# Altium schematic sheet MotorDriverL298.SchDoc
size A
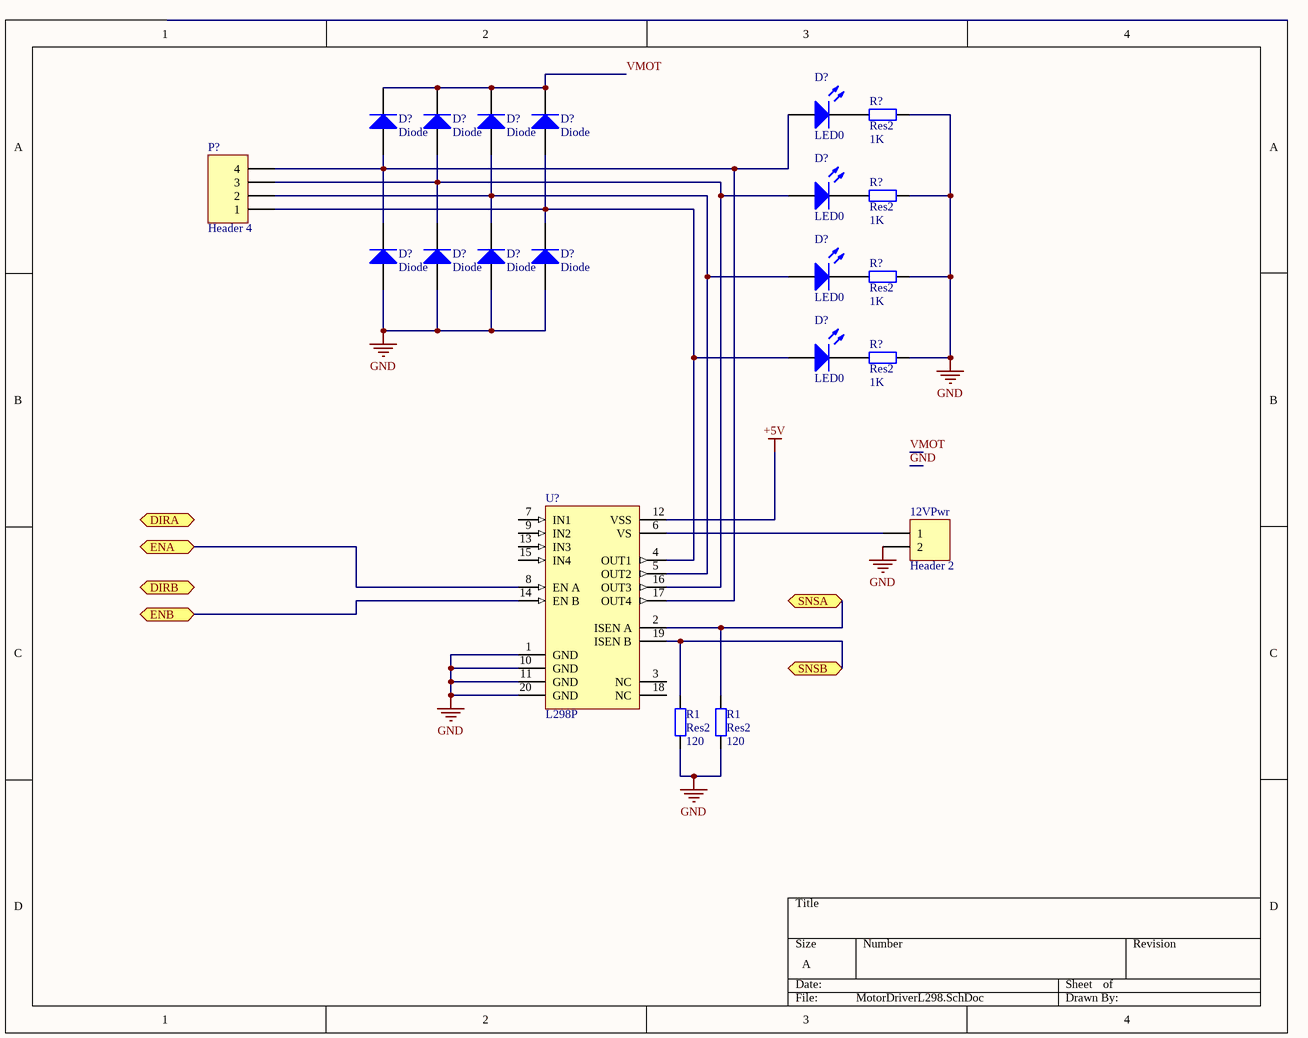
[diagram p0: MotorDriverL298.SchDoc]

## Parts
(Parts that share a designator on the sheet are numbered #1, #2 ... from top to bottom, then left to right.)
12VPwr  Header 2  [HDR1X2]
D?#1  LED0  [LED-0]
D?#2  Diode  [SMC]
D?#3  Diode  [SMC]
D?#4  Diode  [SMC]
D?#5  Diode  [SMC]
D?#6  LED0  [LED-0]
D?#7  Diode  [SMC]
D?#8  Diode  [SMC]
D?#9  Diode  [SMC]
D?#10  Diode  [SMC]
D?#11  LED0  [LED-0]
D?#12  LED0  [LED-0]
P?  Header 4  [HDR1X4]
R1#1  Res2  value 120  [AXIAL-0.4]
R1#2  Res2  value 120  [AXIAL-0.4]
R?#1  Res2  value 1K  [AXIAL-0.4]
R?#2  Res2  value 1K  [AXIAL-0.4]
R?#3  Res2  value 1K  [AXIAL-0.4]
R?#4  Res2  value 1K  [AXIAL-0.4]
U?  L298P  [PowerSO20_N]

## Ports
DIRA, DIRB, ENA, ENB, SNSA, SNSB

## Nets
+5V: U?.12(VSS)
GND: 12VPwr.2 D?#7.1(A) D?#8.1(A) D?#9.1(A) D?#10.1(A) R1#1.1 R1#2.1 R?#1.2 R?#2.2 R?#3.2 R?#4.2 U?.1(GND) U?.10(GND) U?.11(GND) U?.20(GND)
ENA: U?.8(EN_A) ; port ENA
ENB: U?.14(EN_B) ; port ENB
SNSA: R1#2.2 U?.2(ISEN_A) ; port SNSA
SNSB: R1#1.2 U?.19(ISEN_B) ; port SNSB
VMOT: D?#2.2(K) D?#3.2(K) D?#4.2(K) D?#5.2(K)
Net12VPwr_1: 12VPwr.1 U?.6(VS)
NetD?#1_1: D?#1.1(A) D?#2.1(A) D?#7.2(K) P?.4 U?.17(OUT4)
NetD?#1_2: D?#1.2(K) R?#1.1
NetD?#3_1: D?#3.1(A) D?#6.1(A) D?#8.2(K) P?.3 U?.16(OUT3)
NetD?#4_1: D?#4.1(A) D?#9.2(K) D?#11.1(A) P?.2 U?.5(OUT2)
NetD?#5_1: D?#5.1(A) D?#10.2(K) D?#12.1(A) P?.1 U?.4(OUT1)
NetD?#6_2: D?#6.2(K) R?#2.1
NetD?#11_2: D?#11.2(K) R?#3.1
NetD?#12_2: D?#12.2(K) R?#4.1

Not connected (* = marked no-connect by the designer): U? 3(NC) 7(IN1) 9(IN2) 13(IN3) 15(IN4) 18(NC)

## Library data of the parts
12VPwr = Header 2: Header, 2-Pin; LatestRevisionDate: 17-Jul-2002; LatestRevisionNote: Re-released for DXP Platform.; Publisher: Altium Limited
D?#1 D?#6 D?#11 D?#12 = LED0: Typical INFRARED GaAs LED; Published: 8-Jun-2000; LatestRevisionDate: 08-Jul-2005; LatestRevisionNote: Mech Layer 1 removed.; PackageReference: LED-0; Publisher: Altium Limited
D?#2-D?#5 D?#7-D?#10 = Diode: Default Diode; Published: 8-Jun-2000; LatestRevisionDate: 17-Jul-2002; LatestRevisionNote: Re-released for DXP Platform.; PackageDocument: Sep-1996; PackageReference: SMC; Publisher: Altium Limited; Code_JEDEC: DO-214-AB
P? = Header 4: Header, 4-Pin; LatestRevisionDate: 17-Jul-2002; LatestRevisionNote: Re-released for DXP Platform.; Publisher: Altium Limited
R1#1 R1#2 R?#1-R?#4 = Res2: Resistor; Published: 8-Jun-2000; LatestRevisionDate: 17-Jul-2002; LatestRevisionNote: Re-released for DXP Platform.; PackageReference: AXIAL-0.4; Publisher: Altium Limited
U? = L298P: Dual Full Bridge Driver; Published: 8-Jun-2000; LatestRevisionDate: 13-Apr-2006; LatestRevisionNote: IPC-7351 Footprint Added.; DatasheetVersion: Jul-1999; PackageVersion: May-1998; PackageReference: POWERSO20; Publisher: Altium Limited; PackageDescription: 20-Pin Small Outline Package 1.27 mm Pitch; Code_JEDEC: MO-166; ComponentLink1Description: Manufacturer Link; ComponentLink1URL: http://www.st.com/; ComponentLink2Description: Datasheet; ComponentLink2URL: http://www.st.com/stonline/products/literature/ds/1773/l298.pdf